# Altium schematic sheet Current_Detection_9_16.SchDoc: S88-N Occupancy Detector
size A4; DrawnBy: Sem Kirkels; DocumentNumber: 23P001S06; Revision: V1; SheetNumber: 6; SheetTotal: 6
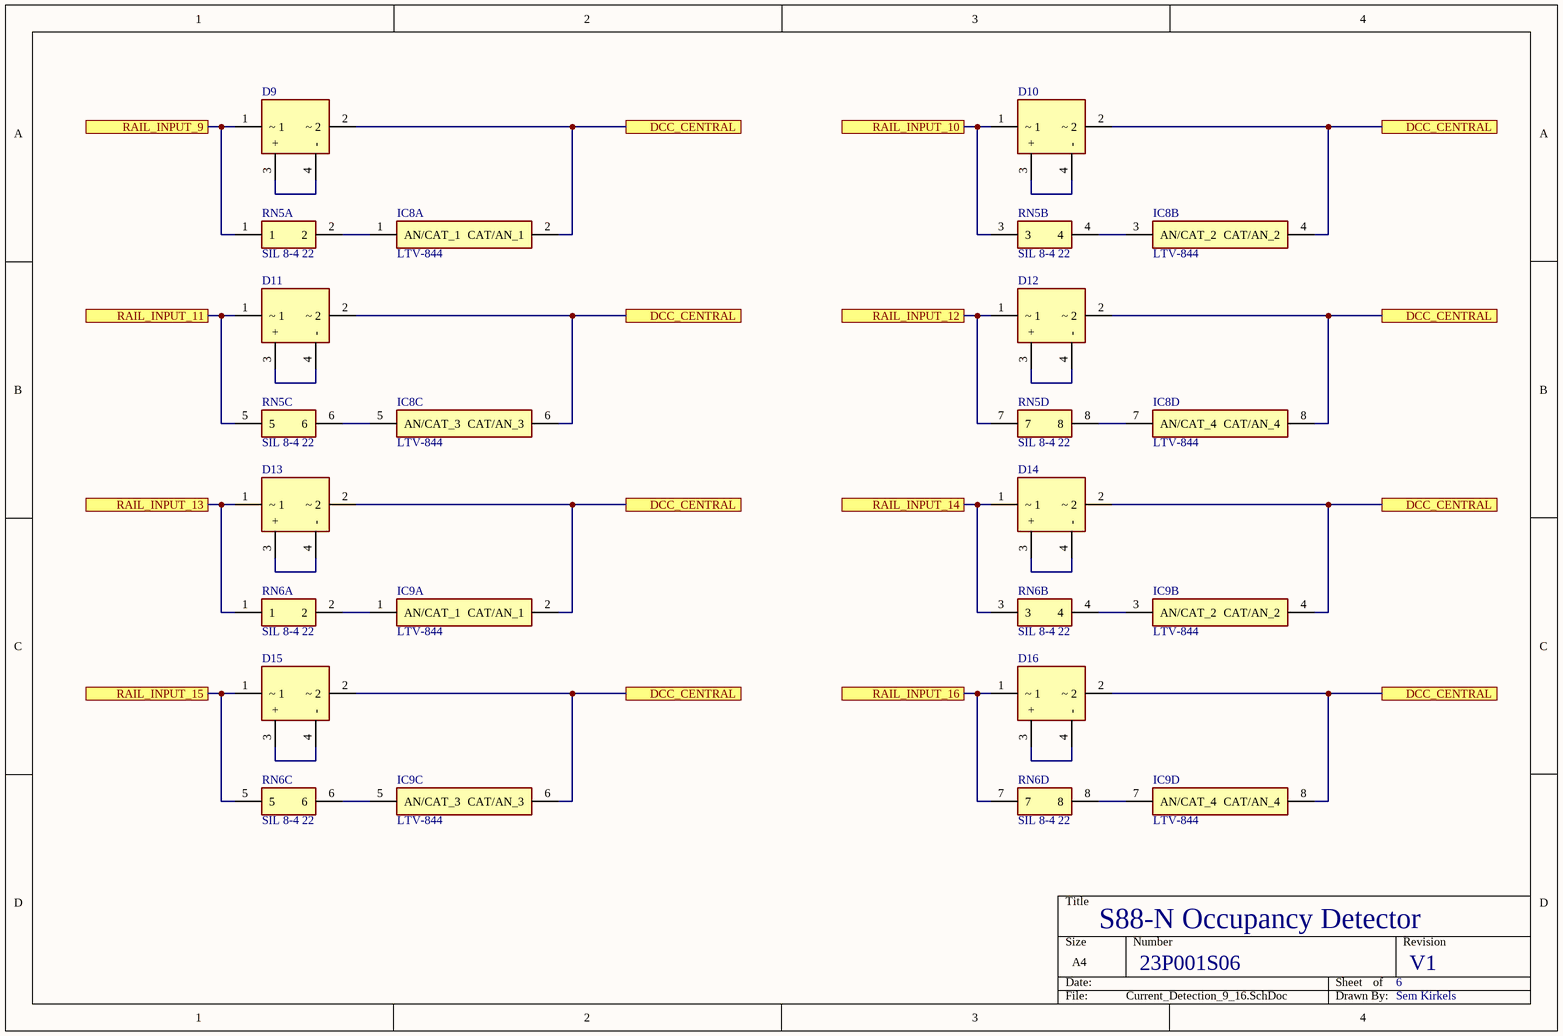
[diagram p0: Current_Detection_9_16.SchDoc]

## Parts
D9  B140C1000DIP_DB101  [FBR_B140C1000DIP]  (value not drawn)
D10  B140C1000DIP_DB101  [FBR_B140C1000DIP]  (value not drawn)
D11  B140C1000DIP_DB101  [FBR_B140C1000DIP]  (value not drawn)
D12  B140C1000DIP_DB101  [FBR_B140C1000DIP]  (value not drawn)
D13  B140C1000DIP_DB101  [FBR_B140C1000DIP]  (value not drawn)
D14  B140C1000DIP_DB101  [FBR_B140C1000DIP]  (value not drawn)
D15  B140C1000DIP_DB101  [FBR_B140C1000DIP]  (value not drawn)
D16  B140C1000DIP_DB101  [FBR_B140C1000DIP]  (value not drawn)
IC8  LTV-844  [CD4014]  (parts A,B,C,D of 5)
IC9  LTV-844  [CD4014]  (parts A,B,C,D of 5)
RN5  SIL 8-4 22  [SIL 8-4]  (parts A,B,C,D of 4)
RN6  SIL 8-4 22  [SIL 8-4]  (parts A,B,C,D of 4)

## Ports
DCC_CENTRAL (see Current_Detection_1_8[2A], Current_Detection_1_8[2B], Current_Detection_1_8[2C], Current_Detection_1_8[4A], Current_Detection_1_8[4B], Current_Detection_1_8[4C], Current_Detection_9_16[2A], Current_Detection_9_16[2B], Current_Detection_9_16[2C], Current_Detection_9_16[4A], Current_Detection_9_16[4B], Current_Detection_9_16[4C], Current_Detection_Connectors[3C]), DCC_CENTRAL (see Current_Detection_1_8[2A], Current_Detection_1_8[2B], Current_Detection_1_8[2C], Current_Detection_1_8[4A], Current_Detection_1_8[4B], Current_Detection_1_8[4C], Current_Detection_9_16[2A], Current_Detection_9_16[2B], Current_Detection_9_16[2C], Current_Detection_9_16[4A], Current_Detection_9_16[4B], Current_Detection_Connectors[3C]), DCC_CENTRAL (see Current_Detection_1_8[2A], Current_Detection_1_8[2B], Current_Detection_1_8[2C], Current_Detection_1_8[4A], Current_Detection_1_8[4B], Current_Detection_1_8[4C], Current_Detection_9_16[2A], Current_Detection_9_16[2B], Current_Detection_9_16[2C], Current_Detection_9_16[4B], Current_Detection_9_16[4C], Current_Detection_Connectors[3C]), DCC_CENTRAL (see Current_Detection_1_8[2A], Current_Detection_1_8[2B], Current_Detection_1_8[2C], Current_Detection_1_8[4A], Current_Detection_1_8[4B], Current_Detection_1_8[4C], Current_Detection_9_16[2A], Current_Detection_9_16[2B], Current_Detection_9_16[4A], Current_Detection_9_16[4B], Current_Detection_9_16[4C], Current_Detection_Connectors[3C]), DCC_CENTRAL (see Current_Detection_1_8[2A], Current_Detection_1_8[2B], Current_Detection_1_8[2C], Current_Detection_1_8[4A], Current_Detection_1_8[4B], Current_Detection_1_8[4C], Current_Detection_9_16[2B], Current_Detection_9_16[2C], Current_Detection_9_16[4A], Current_Detection_9_16[4B], Current_Detection_9_16[4C], Current_Detection_Connectors[3C]), RAIL_INPUT_9 (see Current_Detection_Connectors[3B]), RAIL_INPUT_10 (see Current_Detection_Connectors[3B]), RAIL_INPUT_11 (see Current_Detection_Connectors[3B]), RAIL_INPUT_12 (see Current_Detection_Connectors[3B]), RAIL_INPUT_13 (see Current_Detection_Connectors[3B]), RAIL_INPUT_14 (see Current_Detection_Connectors[3B]), RAIL_INPUT_15 (see Current_Detection_Connectors[3B]), RAIL_INPUT_16 (see Current_Detection_Connectors[3B])

## Nets
DCC_CENTRAL: D9.2(~_2) D10.2(~_2) D11.2(~_2) D12.2(~_2) D13.2(~_2) D14.2(~_2) D15.2(~_2) D16.2(~_2) IC8.2(CAT/AN_1) IC8.4(CAT/AN_2) IC8.6(CAT/AN_3) IC8.8(CAT/AN_4) IC9.2(CAT/AN_1) IC9.4(CAT/AN_2) IC9.6(CAT/AN_3) IC9.8(CAT/AN_4) ; port DCC_CENTRAL
RAIL_INPUT_9: D9.1(~_1) RN5.1 ; port RAIL_INPUT_9
RAIL_INPUT_10: D10.1(~_1) RN5.3 ; port RAIL_INPUT_10
RAIL_INPUT_11: D11.1(~_1) RN5.5 ; port RAIL_INPUT_11
RAIL_INPUT_12: D12.1(~_1) RN5.7 ; port RAIL_INPUT_12
RAIL_INPUT_13: D13.1(~_1) RN6.1 ; port RAIL_INPUT_13
RAIL_INPUT_14: D14.1(~_1) RN6.3 ; port RAIL_INPUT_14
RAIL_INPUT_15: D15.1(~_1) RN6.5 ; port RAIL_INPUT_15
RAIL_INPUT_16: D16.1(~_1) RN6.7 ; port RAIL_INPUT_16
NetD9_3: D9.3(+) D9.4(-)
NetD10_3: D10.3(+) D10.4(-)
NetD11_3: D11.3(+) D11.4(-)
NetD12_3: D12.3(+) D12.4(-)
NetD13_3: D13.3(+) D13.4(-)
NetD14_3: D14.3(+) D14.4(-)
NetD15_3: D15.3(+) D15.4(-)
NetD16_3: D16.3(+) D16.4(-)
NetIC8_1: IC8.1(AN/CAT_1) RN5.2
NetIC8_3: IC8.3(AN/CAT_2) RN5.4
NetIC8_5: IC8.5(AN/CAT_3) RN5.6
NetIC8_7: IC8.7(AN/CAT_4) RN5.8
NetIC9_1: IC9.1(AN/CAT_1) RN6.2
NetIC9_3: IC9.3(AN/CAT_2) RN6.4
NetIC9_5: IC9.5(AN/CAT_3) RN6.6
NetIC9_7: IC9.7(AN/CAT_4) RN6.8

## Library data of the parts
D9-D16 = B140C1000DIP_DB101: Bridge Rectifier; Manufacturer_Name: Rectron; Manufacturer_Part_Number: DB101; Datasheet Link: http://www.rectron.com/data_sheets/db101-107.pdf; Height: 4.9mm; Mouser Part Number: 583-DB101; Mouser Price/Stock: https://www.mouser.co.uk/ProductDetail/Rectron/DB101?qs=G5AQjGfRJcKGSaxDP6qXzQ%3D%3D
IC8 IC9 = LTV-844: Integrated Circuit; Manufacturer_Name: Lite-On; Datasheet Link: https://componentsearchengine.com/Datasheets/1/LTV-844.pdf; Height: 4.5mm; Manufacturer_Part_Number: LTV-844; Mouser Part Number: 859-LTV-844; Mouser Price/Stock: https://www.mouser.co.uk/ProductDetail/Lite-On/LTV-844?qs=BZ0sscl82p8P4kyBjSwzAg%3D%3D; Arrow Part Number: LTV-844; Arrow Price/Stock: https://www.arrow.com/en/products/ltv-844/lite-on-technology?region=nac
RN5 RN6 = SIL 8-4 22: Resistor Network; Manufacturer_Name: Bourns; Manufacturer_Part_Number: 4608X-102-102LF; Datasheet Link: http://www.bourns.com/pdfs/4600X.pdf; Height: 5.08mm; Mouser Part Number: 652-4608X-2LF-1K; Mouser Price/Stock: https://www.mouser.co.uk/ProductDetail/Bourns/4608X-102-102LF?qs=EFWIAreJVABaVln%252BuPVHjA%3D%3D; Arrow Part Number: 4608X-102-102LF; Arrow Price/Stock: https://www.arrow.com/en/products/4608x-102-102lf/bourns?region=europe